# EAGLE design tm7_LEDs (EAGLE 9.6.2)
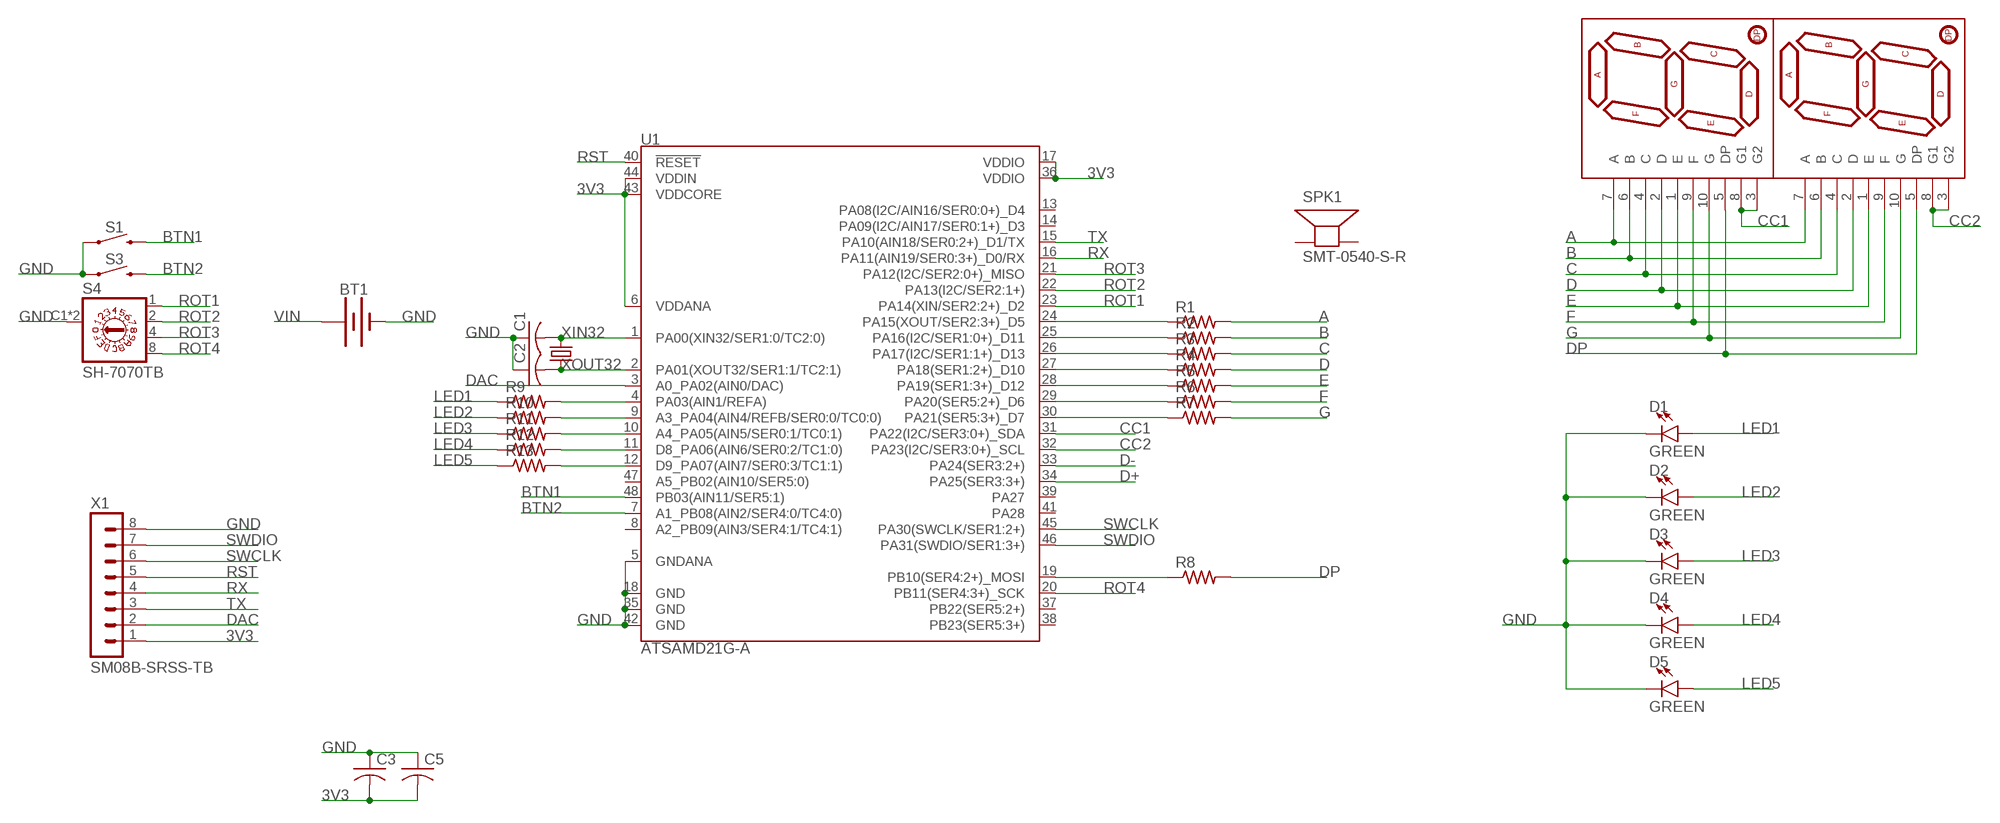
[diagram p0: schematic, sheet 1]

## Parts
BT1  BATTERY-20MM_SMD_4LEGS_OVERPASTE_INNER  [BATTCON_20MM_4LEGS_OVERPASTE_INNER]
C1  C-USC0603  [C0603]
C2  C-USC0603  [C0603]
C3  C-USC0603  [C0603]
C5  C-USC0603  [C0603]
D1  GREEN  LED-GREEN1206  [LED-1206]
D2  GREEN  LED-GREEN1206  [LED-1206]
D3  GREEN  LED-GREEN1206  [LED-1206]
D4  GREEN  LED-GREEN1206  [LED-1206]
D5  GREEN  LED-GREEN1206  [LED-1206]
R1  R-US_R0603  [R0603]
R2  R-US_R0603  [R0603]
R3  R-US_R0603  [R0603]
R4  R-US_R0603  [R0603]
R5  R-US_R0603  [R0603]
R6  R-US_R0603  [R0603]
R7  R-US_R0603  [R0603]
R8  R-US_R0603  [R0603]
R9  R-US_R0603  [R0603]
R10  R-US_R0603  [R0603]
R11  R-US_R0603  [R0603]
R12  R-US_R0603  [R0603]
R13  R-US_R0603  [R0603]
S1  MOMENTARY-SWITCH-SPST-SMD-6.2MM-TALL  [TACTILE_SWITCH_SMD_6.2MM_TALL]
S3  MOMENTARY-SWITCH-SPST-SMD-6.2MM-TALL  [TACTILE_SWITCH_SMD_6.2MM_TALL]
S4  SH-7070TB  [SH-7070B]
SPK1  SMT-0540-S-R  [SMT-0540-S-R]
U1  ATSAMD21G-A  [TQFP-48]
U$2  7-SEGMENT-DISPLAY-1"-RED  [7-SEGMENT-SMD]
U$3  7-SEGMENT-DISPLAY-1"-RED  [7-SEGMENT-SMD]
X1  SM08B-SRSS-TB  [SM08B-SRSS-TB]
Y1  32.768kHz  CRYSTAL-32.768KHZSMD-3.2X1.5  [CRYSTAL-SMD-3.2X1.5MM]

## Nets
3V3: C3.2 C5.2 U1.6(VDDANA) U1.17(VDDIO) U1.36(VDDIO) U1.43(VDDCORE) U1.44(VDDIN) X1.1
A: R1.2 U$2.7(A) U$3.7(A)
B: R2.2 U$2.6(B) U$3.6(B)
BTN1: S1.B2 U1.48(PB03(AIN11/SER5:1))
BTN2: S3.B2 U1.7(A1_PB08(AIN2/SER4:0/TC4:0))
C: R3.2 U$2.4(C) U$3.4(C)
CC1: U1.31(PA22(I2C/SER3:0+)_SDA) U$2.3(G2) U$2.8(G1)
CC2: U1.32(PA23(I2C/SER3:0+)_SCL) U$3.3(G2) U$3.8(G1)
D: R4.2 U$2.2(D) U$3.2(D)
D+: U1.34(PA25(SER3:3+))
D-: U1.33(PA24(SER3:2+))
DAC: U1.3(A0_PA02(AIN0/DAC)) X1.2
DP: R8.2 U$2.5(DP) U$3.5(DP)
E: R5.2 U$2.1(E) U$3.1(E)
F: R6.2 U$2.9(F) U$3.9(F)
G: R7.2 U$2.10(G) U$3.10(G)
GND: BT1.2(-) C1.1 C2.1 C3.1 C5.1 D1.C D2.C D3.C D4.C D5.C S1.A2 S3.A2 S4.C1(C) S4.C2(C) U1.5(GNDANA) U1.18(GND) U1.35(GND) U1.42(GND) X1.8
LED1: D1.A R9.1
LED2: D2.A R10.1
LED3: D3.A R11.1
LED4: D4.A R12.1
LED5: D5.A R13.1
N$1: R1.1 U1.24(PA15(XOUT/SER2:3+)_D5)
N$2: R2.1 U1.25(PA16(I2C/SER1:0+)_D11)
N$3: R3.1 U1.26(PA17(I2C/SER1:1+)_D13)
N$4: R4.1 U1.27(PA18(SER1:2+)_D10)
N$5: R5.1 U1.28(PA19(SER1:3+)_D12)
N$6: R7.1 U1.30(PA21(SER5:3+)_D7)
N$7: R6.1 U1.29(PA20(SER5:2+)_D6)
N$8: R8.1 U1.19(PB10(SER4:2+)_MOSI)
N$9: R9.2 U1.4(PA03(AIN1/REFA))
N$10: R10.2 U1.9(A3_PA04(AIN4/REFB/SER0:0/TC0:0))
N$11: R11.2 U1.10(A4_PA05(AIN5/SER0:1/TC0:1))
N$12: R12.2 U1.11(D8_PA06(AIN6/SER0:2/TC1:0))
N$13: R13.2 U1.12(D9_PA07(AIN7/SER0:3/TC1:1))
ROT1: S4.1 U1.23(PA14(XIN/SER2:2+)_D2)
ROT2: S4.2 U1.22(PA13(I2C/SER2:1+))
ROT3: S4.4 U1.21(PA12(I2C/SER2:0+)_MISO)
ROT4: S4.8 U1.20(PB11(SER4:3+)_SCK)
RST: U1.40(!RESET!) X1.5
RX: U1.16(PA11(AIN19/SER0:3+)_D0/RX) X1.4
SWCLK: U1.45(PA30(SWCLK/SER1:2+)) X1.6
SWDIO: U1.46(PA31(SWDIO/SER1:3+)) X1.7
TX: U1.15(PA10(AIN18/SER0:2+)_D1/TX) X1.3
VIN: BT1.1(+)
XIN32: C1.2 U1.1(PA00(XIN32/SER1:0/TC2:0)) Y1.P$2
XOUT32: C2.2 U1.2(PA01(XOUT32/SER1:1/TC2:1)) Y1.P$1
Unconnected: SPK1.+(-) SPK1.-(+) U1.8(A2_PB09(AIN3/SER4:1/TC4:1)) U1.13(PA08(I2C/AIN16/SER0:0+)_D4) U1.14(PA09(I2C/AIN17/SER0:1+)_D3) U1.37(PB22(SER5:2+)) U1.38(PB23(SER5:3+)) U1.39(PA27) U1.41(PA28) U1.47(A5_PB02(AIN10/SER5:0))

## Library data of the parts
BT1 = SparkFun-Batteries:BATTERY: Battery - Single Cell A variety of battery chemistries, sizes, and footprints. Device List: 20MM_PTH - Coin Cell Battery Holder - 20mm (PTH) <https://www.sparkfun.com/products/783> 20MM_PTH_KIT- Coin Cell battery Holder - 20 mm (PTH) <http://www.sparkfun.com/products/783>kit version with special mask 6.8MM_PTH - Coin Cell Battery Holder - 6.8MM(SMD) <https://www.digikey.com/product-detail/en/seiko-instruments/MS621FE-FL11E/728-1057-ND/1889208?WT.srch=1&gclid=CNOQ5a6LzdQCFZS2wAodXCkE0g> 12MM_SMD - Coin Cell Battery Holder - 12mm (SMD) <https://www.sparkfun.com/products/10592> 12MM_PTH - Coin Cell Battery Holder - 12mm (PTH) <https://www.sparkfun.com/products/7948> 20MM_SMD - 20mm Coin Cell Battery Holder (SMD) (2 legs) Used on the Big Time Watch Kit <https://www.sparkfun.com/products/11734> 20MM_SMD_4LEGS - Coin Cell Battery Holder - 20mm (SMD) <https://www.sparkfun.com/products/11892> 20MM_SMD_4LEGS_OVERPASTE - Coin Cell Battery Holder - 20mm (SMD) <https://www.sparkfun.com/products/11892> (Over-paste on the legs) 24.5MM_PTH - Coin Cell Battery Holder - 24.5mm (PTH) <https://www.sparkfun.com/products/8863> 9V - 9V Battery Holder - PC Mount Used on the SparkFun SparkPunk Sound Kit <https://www.sparkfun.com/products/11177> and SparkFun SparkPunk Sequencer Kit <https://www.sparkfun.com/products/12707> 18650 - Battery Holder - 18650 (PTH) <https://www.sparkfun.com/products/13113> AA - Battery Holder - 1xAA (PTH) <https://www.sparkfun.com/products/7949> AAA - Battery Holder - 1xAAA (PTH) <https://www.sparkfun.com/products/12718> AA_KIT - Battery Holder - 1xAA (PTH) <https://www.sparkfun.com/products/7949> Special kit package - pads only have exposed copper on one side of the board. AAA_KIT - Battery Holder - 1xAAA (PTH) <https://www.sparkfun.com/products/12718> Special kit package - pads only have exposed copper on one side of the board.
C1-C3 C5 = adafruit:C-US: CAPACITOR, American symbol
D1-D5 = SparkFun-LED:LED-GREEN: Green SMD LED Used in manufacturing of various products at SparkFun Packages: 0603 - SMD 0603 package [Product Link] <http://www.futureelectronics.com/en/technologies/semiconductors/optoelectronics/leds/Pages/9894312-LTST-C190GKT.aspx?CrossPart=HSMG-C190&IM=0> LilyPad 1206 - SMD1206 LilyPad package [Product Link] <http://www.futureelectronics.com/en/Technologies/Product.aspx?ProductID=IN150NGHARVATEKCORPORATION2049943&IM=0> 1206 - SMD1206 package [Product Link] <http://www.futureelectronics.com/en/technologies/semiconductors/optoelectronics/leds/Pages/8315665-LTST-C150KGKT.aspx?IM=0> 1206 Bottom Mount -SMD 1206 Bottom Mount [Product Link] <http://www.digikey.com/product-detail/en/lite-on-inc/LTST-C230KGKT/160-1456-1-ND/386854> SparkFun Products: Pro Mini 328 -5V <https://www.sparkfun.com/products/821> RedBoard <https://www.sparkfun.com/products/12757> MP3 Trigger <https://www.sparkfun.com/products/13720> Makey Makey <https://www.sparkfun.com/products/11076>; PROD_ID: DIO-00862
R1-R13 = rcl:R-US_: RESISTOR, American symbol; SPICEPREFIX: R
S1 S3 = SparkFun-Switches:MOMENTARY-SWITCH-SPST: Momentary Switch (Pushbutton) - SPST Normally-open (NO) SPST momentary switches (buttons, pushbuttons). Variants PTH-12MM - 12mm square, through-hole Momentary Pushbutton Switch - 12mm Square <https://www.sparkfun.com/products/9190> (COM-09190) PTH-6.0MM, PTH-6.0MM-KIT - 6.0mm square, through-hole Mini Pushbutton Switch <https://www.sparkfun.com/products/97> (COM-00097) KIT package intended for soldering kit's - only one side of pads' copper is exposed. PTH-RIGHT-ANGLE-KIT - Right-angle, through-hole Right Angle Tactile Button <https://www.sparkfun.com/products/10791> - Used on SparkFun BigTime Watch Kit <https://www.sparkfun.com/products/11734> SMD-12MM - 12mm square, surface-mount Tactile Button - SMD (12mm) <https://www.sparkfun.com/products/12993> (COM-12993) Used on SparkFun PicoBoard <https://www.sparkfun.com/products/11888> SMD-4.5MM - 4.5mm Square Trackball Switch Used on SparkFun Blackberry Trackballer Breakout <https://www.sparkfun.com/products/13169> SMD-4.6MMX2.8MM - 4.60mm x 2.80mm, surface mount Used on SparkFun SAMD21 Mini Breakout <https://www.sparkfun.com/products/13664> SMD-5.2MM, SMD-5.2-REDUNDANT - 5.2mm square, surface-mount Mini Pushbutton Switch - SMD <https://www.sparkfun.com/products/8720> (COM-08720) Used on Arduino Pro Mini <https://www.sparkfun.com/products/11114> REDUNDANT package connects both switch circuits together SMD-6.0X3.5MM - 6.0 x 3.5mm, surface mount Momentary Reset Switch SMD <https://www.sparkfun.com/products/8229> (COM-08229) SMD-6.2MM-TALL - 6.2mm square, surface mount Tactile Button - SMD (6mm) <https://www.sparkfun.com/products/12992> Used on SparkFun Digital Sandbox <https://www.sparkfun.com/products/12651> SMD-RIGHT-ANGLE - Right-angle, surface mount Used on SparkFun Block for Intel® Edison - Arduino <https://www.sparkfun.com/products/13036>; PROD_ID: SWCH-11966; SF_SKU: COM-12992
S4 = SH-7070TB:SH-7070TB: ROTARY CODED HEX SWITCH Check availability <https://pricing.snapeda.com/parts/SH-7070TB/Nidec%20Copal/view-part?ref=eda>; AVAILABILITY: In Stock; DESCRIPTION: Dip Switch Hexadecimal Complement 16 Position Surface Mount Rotary for Tool Actuator 100mA 5VDC; MF: Nidec Copal; MP: SH-7070TB; PACKAGE: None; PRICE: None; PURCHASE-URL: https://pricing.snapeda.com/search/part/SH-7070TB/?ref=eda
SPK1 = SMT-0540-S-R:SMT-0540-S-R: SMT-0549-S-R Small surface-mount magnetic buzzer Check availability <https://pricing.snapeda.com/parts/SMT-0540-S-R/PUI/view-part?ref=eda>; AVAILABILITY: In Stock; DESCRIPTION: SURFACE MOUNT TRANSDUCER 3V0-P 100MA; MF: PUI; MP: SMT-0540-S-R; PACKAGE: None; PRICE: None; PURCHASE-URL: https://pricing.snapeda.com/search/part/SMT-0540-S-R/?ref=eda
U1 = SparkFun-IC-Microcontroller:ATSAMD21G: Atmel SAMD21G SMART ARM-Based Microcontroller The Atmel ® | SMART ™ SAM D21 is a series of low-power microcontrollers using the 32-bit ARM ® Cortex ® -M0+ processor, and ranging from 32- to 64-pins with up to 256KB Flash and 32KB of SRAM. The SAM D21 devices operate at a maximum frequency of 48MHz and reach 2.46 CoreMark/MHz. They are designed for simple and intuitive migration with identical peripheral modules, hex compatible code, identical linear address map and pin compatible migration paths between all devices in the product series. All devices include intelligent and flexible peripherals, Atmel Event System for inter-peripheral signaling, and support for capacitive touch button, slider and wheel user interfaces. Datasheet <https://cdn.sparkfun.com/datasheets/Dev/Arduino/Boards/Atmel-42181-SAM-D21_Datasheet.pdf> SparkFun Products SparkFun SAMD21 Mini Breakout <https://www.sparkfun.com/products/13664> (DEV-13664) SparkFun SAMD21 Dev Breakout <https://www.sparkfun.com/products/13672> (DEV-13672) (DEV-14926); PROD_ID: IC-13064
U$2 U$3 = balto:7-SEGMENT-DISPLAY-1"-RED: 7-Segment Display 1" Red (COM-08546)
X1 = con-JST:SM08B-SRSS: JST SH series header 1.00mm pitch disconnectable crimp style connectors, horizontal (side entry type), 8 pins
Y1 = SparkFun-Clocks:CRYSTAL-32.768KHZ: 32.768kHz Crystal Frequency: 32.768kHz Frequency Stability: ±20ppm Load Capacitance: 12.5pF (PTH-2X6 & SMD-3.2X1.5), 6pF (SMD-2X6) SparkFun Products: SparkFun BigTime Watch Kit <https://www.sparkfun.com/products/11734> SparkFun nRF52832 Breakout <https://www.sparkfun.com/products/13990> SparkFun Real Time Clock Module <https://www.sparkfun.com/products/12708>; PROD_ID: XTAL-13062

## Board
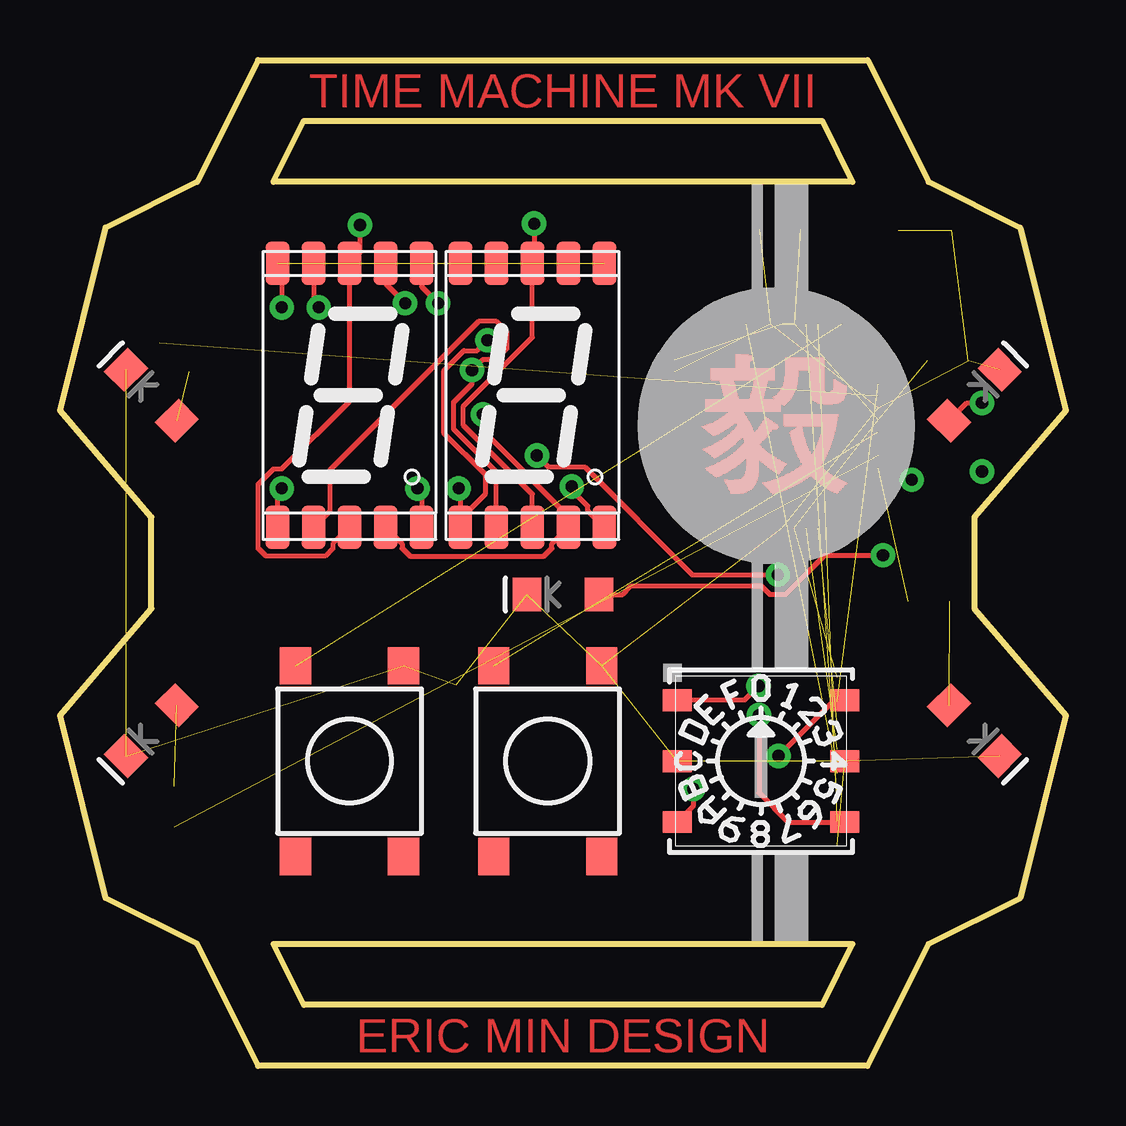
[diagram p1: board, top side]
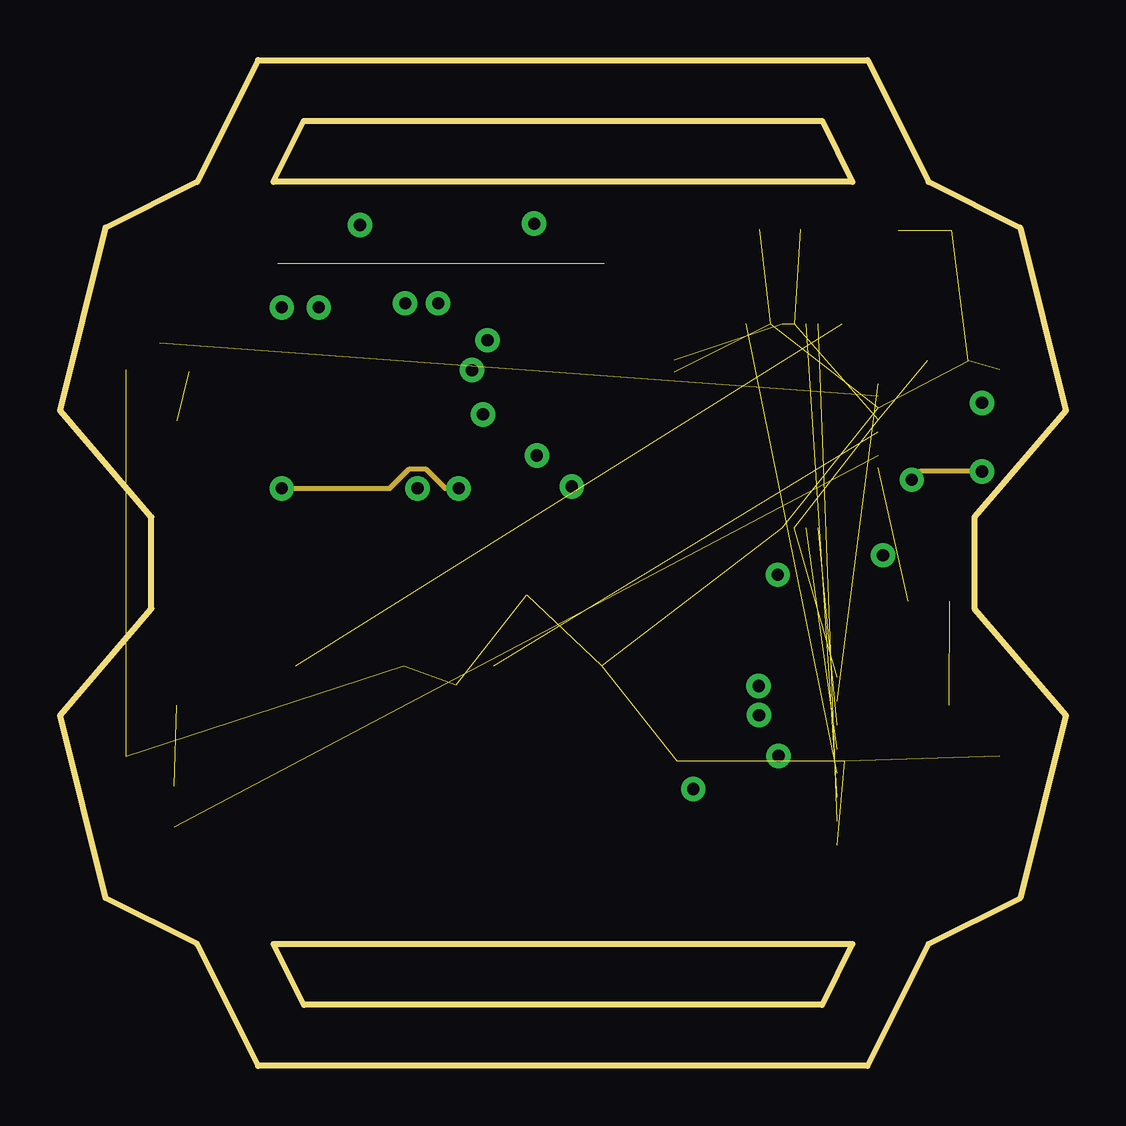
[diagram p2: board, inner layer Route2]
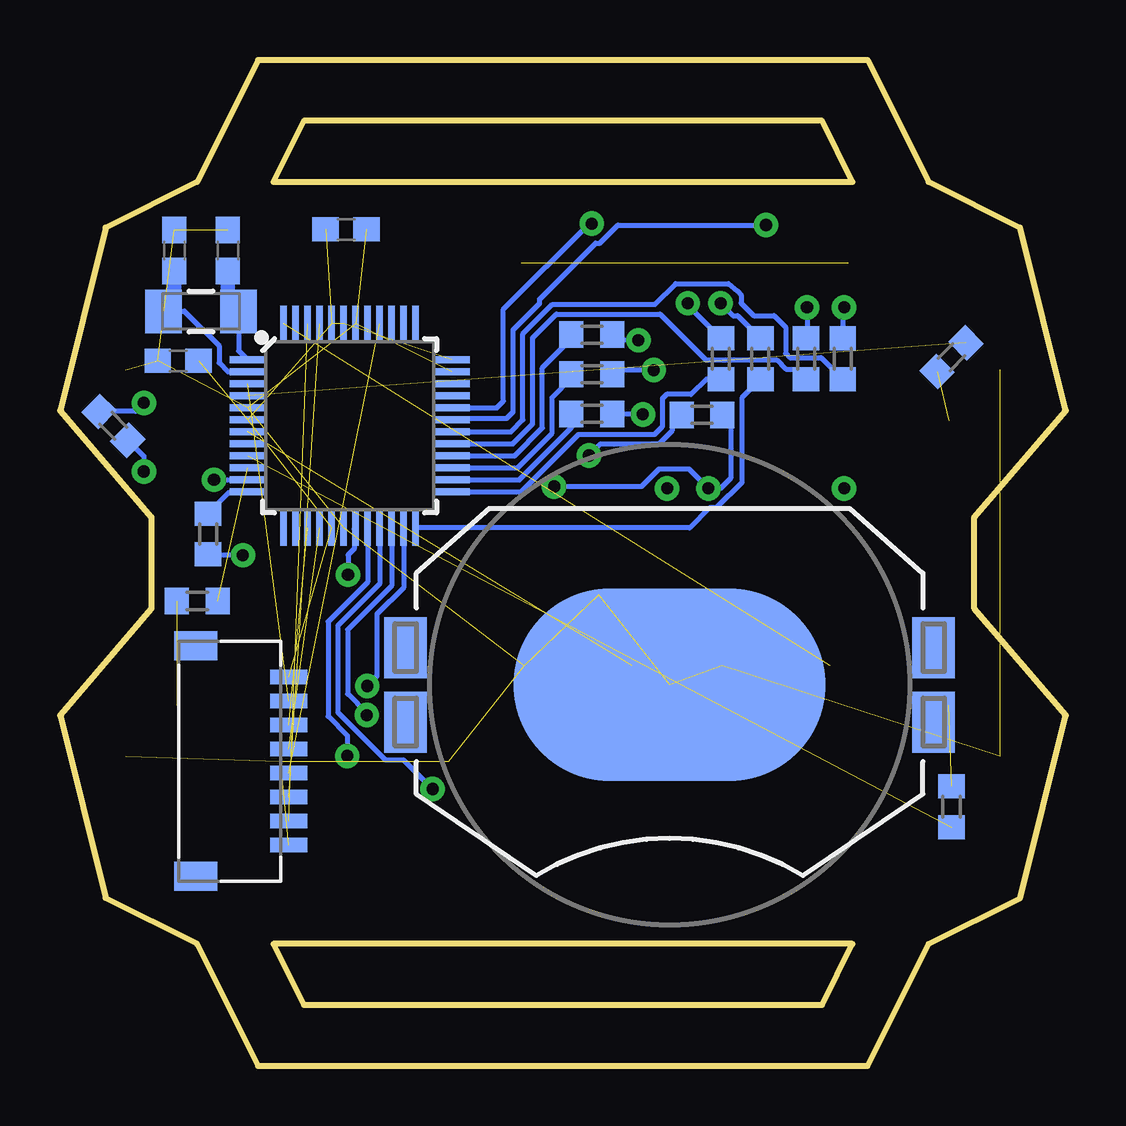
[diagram p3: board, bottom side, seen from below]

Size 41.91 x 41.91 mm. Coordinates in mm from the lower left corner, seen from the top.
Outline: 33.66,0 8.25,0 5.71,5.08 1.9,6.98 0,14.61 3.81,19.05 3.81,22.86 0,27.3 1.9,34.92 5.71,36.83 8.25,41.91 33.66,41.91 36.19,36.83 40,34.92 41.91,27.3 38.1,22.86 38.1,19.05 41.91,14.61 40,6.98 36.19,5.08 33.66,0
Outline: 8.89,36.83 10.16,39.37 31.75,39.37 33.02,36.83 8.89,36.83
Outline: 33.02,5.08 31.75,2.54 10.16,2.54 8.89,5.08 33.02,5.08
Copper layers (1+2*15+16): Top 0.035mm / dielectric 1.5mm / Route2 0.035mm / dielectric 0.15mm / Route15 0.035mm / dielectric 0.2mm / Bottom 0.035mm
Design rules "default *": minimum track width 8mil, minimum drill 20mil, track to track 8mil, track to pad 8mil, pad to pad 8mil, via to via 8mil, smd to smd 8mil, copper to edge 10mil, drill to drill 8mil, minimum pad ring 12mil, minimum via ring 10mil, stop-mask expansion 4mil, vias tented up to drill 25mil, thermal gap 10mil

### Footprints (pad centres in the part's own frame; a part is rotated, then mirrored left to right if it is on the bottom)
BATTCON_20MM_4LEGS_OVERPASTE_INNER = smd 1.778 x 2.54: 1 -11,1.55; 3 11,1.55; P$1 -11,-1.55; P$2 11,-1.55 | smd 13 x 8: 2 0,0
C0603 = smd 1.1 x 1: 1 -0.85,0; 2 0.85,0
LED-1206 = smd 1.2 x 1.4: A -1.5,0; C 1.5,0
R0603 = smd 1 x 1.1: 1 -0.85,0; 2 0.85,0
TACTILE_SWITCH_SMD_6.2MM_TALL = smd 1.55 x 1.3: A1 -3.975,-2.25; A2 3.975,-2.25; B1 -3.975,2.25; B2 3.975,2.25
SH-7070B = smd 1.219 x 0.914: 1 -2.223,3.81; 2 4.763,-1.27; 4 -2.223,-1.27; 8 4.763,3.81; C1 -2.223,1.27; C2 4.763,1.27
SMT-0540-S-R = smd 1 x 1: + 1.7,-2.7; - 1.7,2.7; M -1.7,-2.7
TQFP-48 = smd 1.5 x 0.28: 1 -4.25,2.75; 2 -4.25,2.25; 3 -4.25,1.75; 4 -4.25,1.25; 5 -4.25,0.75; 6 -4.25,0.25; 7 -4.25,-0.25; 8 -4.25,-0.75; 9 -4.25,-1.25; 10 -4.25,-1.75; 11 -4.25,-2.25; 12 -4.25,-2.75; 25 4.25,-2.75; 26 4.25,-2.25; 27 4.25,-1.75; 28 4.25,-1.25; 29 4.25,-0.75; 30 4.25,-0.25; 31 4.25,0.25; 32 4.25,0.75; 33 4.25,1.25; 34 4.25,1.75; 35 4.25,2.25; 36 4.25,2.75 | smd 0.28 x 1.5: 13 -2.75,-4.25; 14 -2.25,-4.25; 15 -1.75,-4.25; 16 -1.25,-4.25; 17 -0.75,-4.25; 18 -0.25,-4.25; 19 0.25,-4.25; 20 0.75,-4.25; 21 1.25,-4.25; 22 1.75,-4.25; 23 2.25,-4.25; 24 2.75,-4.25; 37 2.75,4.25; 38 2.25,4.25; 39 1.75,4.25; 40 1.25,4.25; 41 0.75,4.25; 42 0.25,4.25; 43 -0.25,4.25; 44 -0.75,4.25; 45 -1.25,4.25; 46 -1.75,4.25; 47 -2.25,4.25; 48 -2.75,4.25
7-SEGMENT-SMD = smd 1 x 1.8: 1 -3,-5.5; 2 -1.5,-5.5; 3 0,-5.5; 4 1.5,-5.5; 5 3,-5.5; 6 3,5.5; 7 1.5,5.5; 8 0,5.5; 9 -1.5,5.5; 10 -3,5.5
SM08B-SRSS-TB = smd 0.6 x 1.55: 1 3.5,0; 2 2.5,0; 3 1.5,0; 4 0.5,0; 5 -0.5,0; 6 -1.5,0; 7 -2.5,0; 8 -3.5,0 | smd 1.2 x 1.8: M1 4.8,3.875; M2 -4.8,3.875
CRYSTAL-SMD-3.2X1.5MM = smd 1.524 x 1.8: P$1 -1.567,0; P$2 1.567,0

### Placement (x,y rotation side)
BT1  16.51,15.88 0 bottom
C1  34.92,33.97 270 bottom
C2  37.15,33.97 270 bottom
C3  29.99,34.86 180 bottom
C5  36.99,29.37 0 bottom
D1  3.81,27.94 135 top
D2  3.81,13.97 225 top
D3  38.1,13.97 315 top
D4  38.1,27.94 45 top
D5  20.96,19.63 180 top
R1  12.73,29.46 90 bottom
R2  14.38,29.46 90 bottom
R3  19.75,27.17 0 bottom
R4  19.75,28.82 0 bottom
R5  19.75,30.47 0 bottom
R6  10.82,29.46 90 bottom
R7  9.3,29.46 90 bottom
R8  15.16,27.12 0 bottom
R9  4.76,29.53 45 bottom
R10  4.76,10.8 270 bottom
R11  36.19,19.37 0 bottom
R12  39.69,26.67 315 bottom
R13  35.74,22.16 90 bottom
S1  12.06,12.7 90 top
S3  20.32,12.7 90 top
S4  27.94,11.43 0 top
SPK1  49.21,19.68 0 bottom  (outside the outline)
U1  29.85,26.67 0 bottom
U$2  12.06,27.94 0 top
U$3  19.68,27.94 0 top
X1  32.39,12.7 90 bottom
Y1  36.04,31.43 0 bottom

### Tracks (layer width: path | path; a pad name or v marks a point on that pad's centre or on a via)
3V3  (7 unrouted)
A  (via drill 0.51)  (1 unrouted)
  Top 0.203: U$2.7 13.57,32.59 v14.38,31.77
  Bottom 0.203: v14.38,31.77 13.87,31.26 13.67,31.26 R1.2
B  (via drill 0.51)  (1 unrouted)
  Top 0.203: U$2.6 15.07,32.47 v15.75,31.77
  Bottom 0.203: v15.75,31.77 15.75,31.69 R2.2
BTN1  (1 unrouted)
BTN2  (1 unrouted)
C  (via drill 0.51)
  Top 0.203: v17.62,27.15 17.62,26.46 21.18,22.9 U$3.4 20.49,21.74 20.49,21.56 20.17,21.23 14.58,21.23 14.26,21.56 14.26,21.74 U$2.4
  Bottom 0.203: v17.62,27.15 18.88,27.15 R3.2
CC1  (via drill 0.51)
  Top 0.203: U$2.3 11.37,21.74 11.37,21.56 11.04,21.23 8.59,21.23 8.26,21.56 8.26,24.23 8.9,24.87 9.24,24.87 12.06,27.7 U$2.8 12.5,33.87 v12.5,35.03
  Bottom 0.203: U1.31 25.54,26.98 23.3,26.98 23.03,27.24 23.03,30.67 21.93,31.77 21.93,31.95 19.6,34.28 19.42,34.28 18.66,35.03 v12.5,35.03
CC2  (via drill 0.51)
  Top 0.203: v19.75,35.09 19.75,33.51 U$3.8 19.68,30.36 16.81,27.48 16.81,26.7 19.68,23.83 U$3.3
  Bottom 0.203: U1.32 23.71,27.42 23.43,27.7 23.43,31.52 19.87,35.09 v19.75,35.09
D  (via drill 0.51)
  Top 0.203: U$3.2 18.18,24.75 16.41,26.53 16.41,27.65 17.17,28.41 v17.17,28.99 17.6,29.42 18.15,29.42 18.62,29.9 18.62,30.57 18.15,31.05 17.47,31.05 11.26,24.83 11.26,23.13 U$2.2
  Bottom 0.203: v17.17,28.99 18.73,28.99 R4.2
DAC  (1 unrouted)
DP  (via drill 0.51)
  Top 0.203: U$3.5 21.99,23.13 21.99,23.32 21.32,23.99 v21.32,24.14 | v14.9,24.06 15.07,23.89 U$2.5
  Bottom 0.203: 14.65,27.12 R8.2 13.96,26.78 13.96,24.48 14.38,24.06 v14.9,24.06 14.98,24.14 15.71,24.87 16.95,24.87 17.68,24.14 v21.32,24.14
E  (via drill 0.51)
  Top 0.203: v17.81,30.23 17.38,29.8 16.83,29.8 16,28.97 16,26.36 17.71,24.65 17.71,23.81 16.68,22.78 U$3.1 16.68,23.99 v16.61,24.06 | U$2.1 9.06,23.89 v9.24,24.06
  Route2 0.203: v9.24,24.06 13.75,24.06 14.56,24.87 15.23,24.87 16.05,24.06 v16.61,24.06
  Bottom 0.203: v17.81,30.23 18.66,30.23 R5.2
F  (via drill 0.51)  (1 unrouted)
  Top 0.203: U$2.9 10.56,31.82 v10.78,31.6
  Bottom 0.203: v10.78,31.6 10.78,30.35 R6.2
G  (via drill 0.51)  (1 unrouted)
  Top 0.203: U$2.10 9.24,33.27 v9.24,31.6
  Bottom 0.203: v9.24,31.6 9.3,31.55 R7.2
GND  (18 unrouted)
LED1  (1 unrouted)
LED2  (1 unrouted)
LED3  (1 unrouted)
LED4  (via drill 0.51)
  Top 0.203: D4.A 37.78,27.62 v38.42,27.62
  Bottom 0.203: v38.42,27.62 38.77,27.27 R12.1
LED5  (via drill 0.51)
  Top 0.203: D5.A 23.44,19.63 23.81,20 29.22,20 29.57,19.65 30.24,19.65 31.87,21.27 v34.29,21.27
  Bottom 0.203: v34.29,21.27 35.7,21.27 R13.1
N$1
  Bottom 0.203: U1.24 15.68,22.42 14.85,23.25 14.56,23.25 13.5,24.3 13.5,27.84 R1.1
N$2
  Bottom 0.203: U1.25 22.69,23.92 20.3,26.31 17.13,26.31 16.81,26.63 16.81,27.8 16.63,27.98 15.61,27.98 14.97,28.61 R2.1
N$3
  Bottom 0.203: U1.26 22.77,24.42 20.6,26.59 R3.1
N$4
  Bottom 0.203: U1.27 22.84,24.92 21.4,26.36 21.4,27.84 20.6,28.65 R4.1
N$5
  Bottom 0.203: U1.28 22.97,25.42 21.81,26.58 21.81,29.09 20.6,30.3 R5.1
N$6
  Bottom 0.203: U1.30 23.12,26.42 22.62,26.91 22.62,30.5 21.39,31.73 17.12,31.73 16.26,32.59 14.05,32.59 13.7,32.29 13.53,32.12 13.53,31.77 13.01,31.26 12.15,31.26 11.68,30.78 11.68,29.69 11.5,29.51 10.19,29.51 R7.1
N$7
  Bottom 0.203: U1.29 23.04,25.92 22.22,26.75 22.22,30.33 21.22,31.32 16.9,31.32 15,29.42 12.05,29.42 11.66,29.03 10.44,29.03 10.44,28.99 R6.1
N$8  (via drill 0.51)
  Top 0.203: v19.87,25.43 20.35,24.95 21.86,24.95 26.35,20.46 v29.91,20.46
  Bottom 0.203: U1.19 29.65,22.37 29.65,21.54 29.91,21.29 v29.91,20.46 | v19.87,25.43 19.4,25.9 16.96,25.9 16.41,26.46 16.41,26.72 R8.1
N$9  (1 unrouted)
N$10  (1 unrouted)
N$11  (1 unrouted)
N$12  (via drill 0.51)
  Route2 0.203: v38.42,24.77 35.84,24.77 v35.49,24.42
  Bottom 0.203: R12.2 38.42,25.4 v38.42,24.77 | v35.49,24.42 U1.11
N$13
  Bottom 0.203: R13.2 34.83,23.92 U1.12
ROT1  (via drill 0.51)
  Top 0.203: v29.11,15.83 28.52,15.24 S4.1
  Bottom 0.203: v29.11,15.83 28.7,16.24 28.7,18.82 27.6,19.93 U1.23
ROT2  (via drill 0.51)
  Top 0.203: v29.13,14.61 29.13,11.37 30.34,10.16 S4.2
  Bottom 0.203: U1.22 28.1,20 29.92,18.18 29.92,15.49 29.13,14.7 v29.13,14.61
ROT3  (via drill 0.51)
  Top 0.203: v26.38,11.53 26.38,10.83 S4.4
  Bottom 0.203: U1.21 28.6,20.08 30.33,18.34 30.33,14.73 28.35,12.75 27.6,12.75 v26.38,11.53
ROT4  (via drill 0.51)
  Top 0.203: v29.94,12.92 32.26,15.24 S4.8
  Bottom 0.203: U1.20 29.1,20.15 30.74,18.51 30.74,14.56 29.94,13.76 v29.94,12.92
RST  (1 unrouted)
RX  (1 unrouted)
SWCLK  (1 unrouted)
SWDIO  (1 unrouted)
TX  (1 unrouted)
XIN32
  Bottom 0.203: Y1.P$2 34.47,29.79 U1.1
  Bottom 0.61: Y1.P$2 34.92,31.89 C1.2
XOUT32
  Bottom 0.203: Y1.P$1 37.59,31.44 36.73,31.44 35.28,29.99 35.28,29.29 34.92,28.92 U1.2
  Bottom 0.61: Y1.P$1 37.15,31.89 C2.2
(copper drawn outside any net)
  shapes: Top area x755

### Text on the board
Top: TIME MACHINE MK VII | ERIC MIN DESIGN
tStop: TIME MACHINE MK VII | ERIC MIN DESIGN